# Altium project KeyBoard.PrjPcb
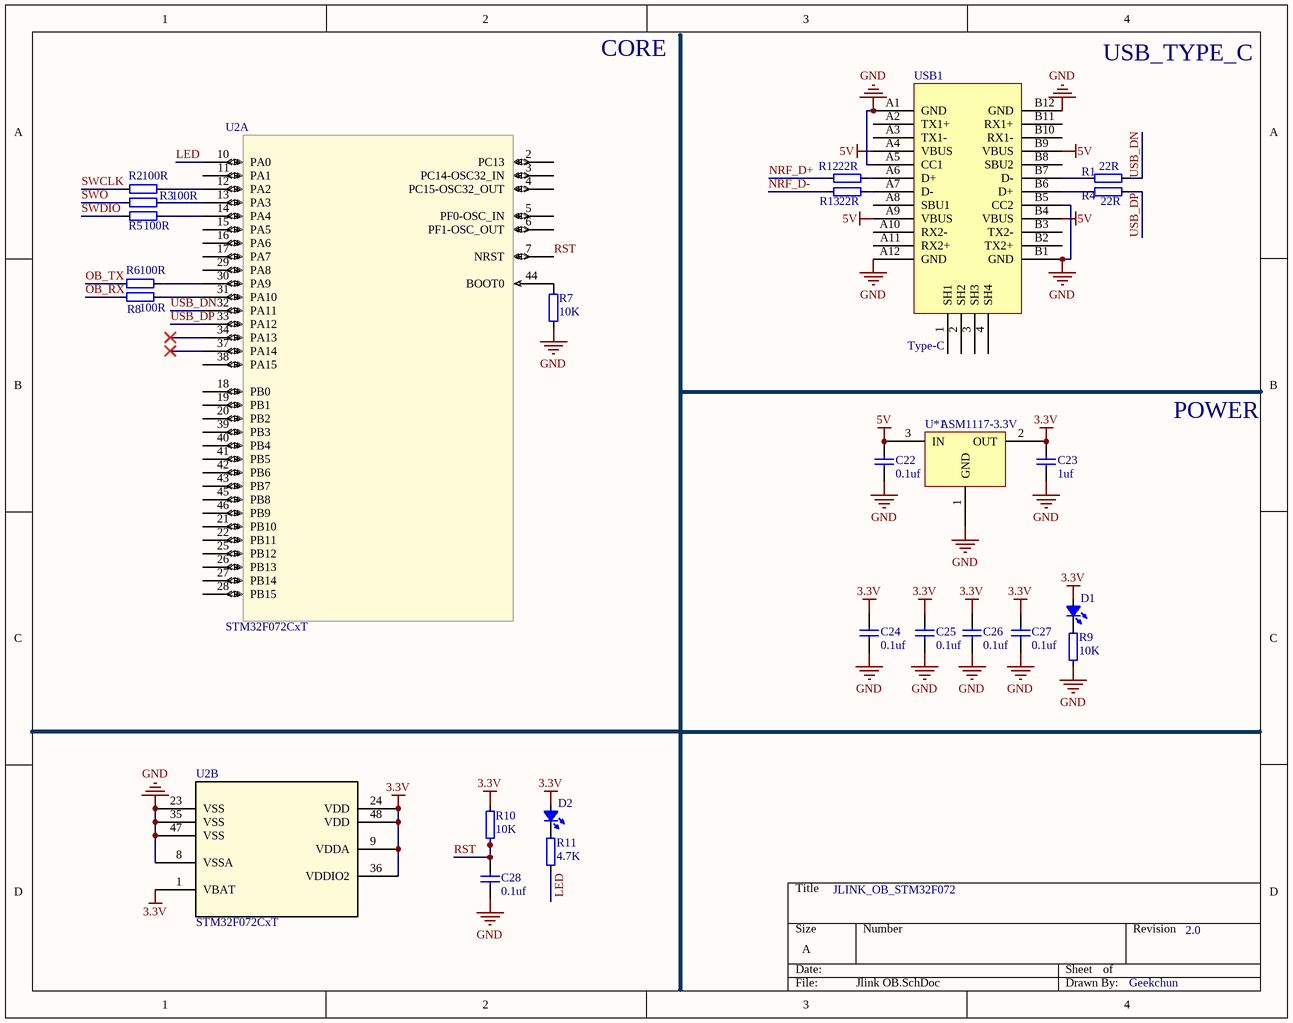
[diagram p0: Jlink OB.SchDoc]
3 sheets, 83 parts. Net scope: global (net labels, ports and power ports of the same name join across sheets).
Board file: KeyBoard.PcbDoc
Sheets:
  Jlink OB.SchDoc
  NRF52840.SchDoc
  Keys.SchDoc

## Sheet Jlink OB.SchDoc
size A

### Parts
C22  0.1uf  [C 0603_L]
C23  1uf  [C 0603_L]
C24  0.1uf  [C 0603_L]
C25  0.1uf  [C 0603_L]
C26  0.1uf  [C 0603_L]
C27  0.1uf  [C 0603_L]
C28  0.1uf  [C 0603_L]
D1  LED_0603  [LED 0603B]  (value not drawn)
D2  LED_0603  [LED 0603B]  (value not drawn)
R1  22R  [R 0603_L]
R2  100R  [R 0603_L]
R3  100R  [R 0603_L]
R4  22R  [R 0603_L]
R5  100R  [R 0603_L]
R6  100R  [R 0603_L]
R7  10K  [R 0603_L]
R8  100R  [R 0603_L]
R9  10K  [R 0603_L]
R10  10K  [R 0603_L]
R11  4.7K  [R 0603_L]
R12  22R  [R 0603_L]
R13  22R  [R 0603_L]
U2  STM32F072CxT  [LQFP48 7X7_L]  (parts A,B of 2)
U*1  ASM1117-3.3V  [SOT-89]
USB1  Type-C  [usb typec]

### Nets
3.3V: C23.2 C24.2 C25.2 C26.2 C27.2 D1.1(A) D2.1(A) R10.2 U2.1(VBAT) U2.9(VDDA) U2.24(VDD) U2.36(VDDIO2) U2.48(VDD) U*1.2(OUT)
5V: C22.2 U*1.3(IN) USB1.A4(VBUS) USB1.A9(VBUS) USB1.B4(VBUS) USB1.B9(VBUS)
GND: C22.1 C23.1 C24.1 C25.1 C26.1 C27.1 C28.1 R7.2 R9.1 U2.8(VSSA) U2.23(VSS) U2.35(VSS) U2.47(VSS) U*1.1(GND) USB1.A1(GND) USB1.A5(CC1) USB1.A12(GND) USB1.B1(GND) USB1.B5(CC2) USB1.B12(GND)
LED: R11.1 U2.10(PA0)
NRF_D+: R12.1
NRF_D-: R13.1
OB_RX: R8.1
OB_TX: R6.1
RST: C28.2 R10.1 U2.7(NRST)
SWCLK: R2.1
SWDIO: R5.1
SWO: R3.1
USB_DN: R1.2 U2.32(PA11)
USB_DP: R4.2 U2.33(PA12)
NetD1_2: D1.2(K) R9.2
NetD2_2: D2.2(K) R11.2
NetR1_1: R1.1 USB1.B7(D-)
NetR2_2: R2.2 U2.12(PA2)
NetR3_2: R3.2 U2.13(PA3)
NetR4_1: R4.1 USB1.B6(D+)
NetR5_2: R5.2 U2.14(PA4)
NetR6_2: R6.2 U2.30(PA9)
NetR7_1: R7.1 U2.44(BOOT0)
NetR8_2: R8.2 U2.31(PA10)
NetR12_2: R12.2 USB1.A6(D+)
NetR13_2: R13.2 USB1.A7(D-)

Not connected (* = marked no-connect by the designer): U2 2(PC13) 3(PC14-OSC32_IN) 4(PC15-OSC32_OUT) 5(PF0-OSC_IN) 6(PF1-OSC_OUT) 11(PA1) 15(PA5) 16(PA6) 17(PA7) 18(PB0) 19(PB1) 20(PB2) 21(PB10) 22(PB11) 25(PB12) 26(PB13) 27(PB14) 28(PB15) 29(PA8) 34(PA13)* 37(PA14)* 38(PA15) 39(PB3) 40(PB4) 41(PB5) 42(PB6) 43(PB7) 45(PB8) 46(PB9); USB1 1(SH1) 2(SH2) 3(SH3) 4(SH4) A2(TX1+) A3(TX1-) A8(SBU1) A10(RX2-) A11(RX2+) B2(TX2+) B3(TX2-) B8(SBU2) B10(RX1-) B11(RX1+)

### Notes on the sheet
- CORE
- USB_TYPE_C
- POWER
- JLINK_OB_STM32F072
- 2.0
- Geekchun

### Library data of the parts
C22-C28 = CAP: Capacitor, NP0, ?.1pF; Part Number: C0402-1.2p; Value: 1.2pF; Note: 50V; Artikkelnr Noca: 20029157; Artikkelnr Simpro: N.A.; Manufacturer: *; Manufacturer Part Number: *; Datasheet: *; LatestRevisionDate: 2011-05-11; Pin Count: 2; Publisher: Nordic Semiconductor; Published: 2009-05-08; Supplier: *; Supplier part number: *; 2nd source Supplier: *; 2nd source part number: *; Footprint Doc: 0402
D1 D2 = LED_0603: LED
R1-R13 = RES
U2 = STM32F072CxT: Imported; Vendor: STMicroelectronics; C: Copyright (C) 2016 Accelerated Designs. All rights reserved; Copyright: Copyright (C) 2016 Accelerated Designs. All rights reserved; Manufacturer_Part_Number: stm32f072cxt; RefDes: RefDes; Type: Type; Value: Value
U*1 = ASM1117-3.3V: 三端可调或固定电压3.3V

## Sheet NRF52840.SchDoc
size A4
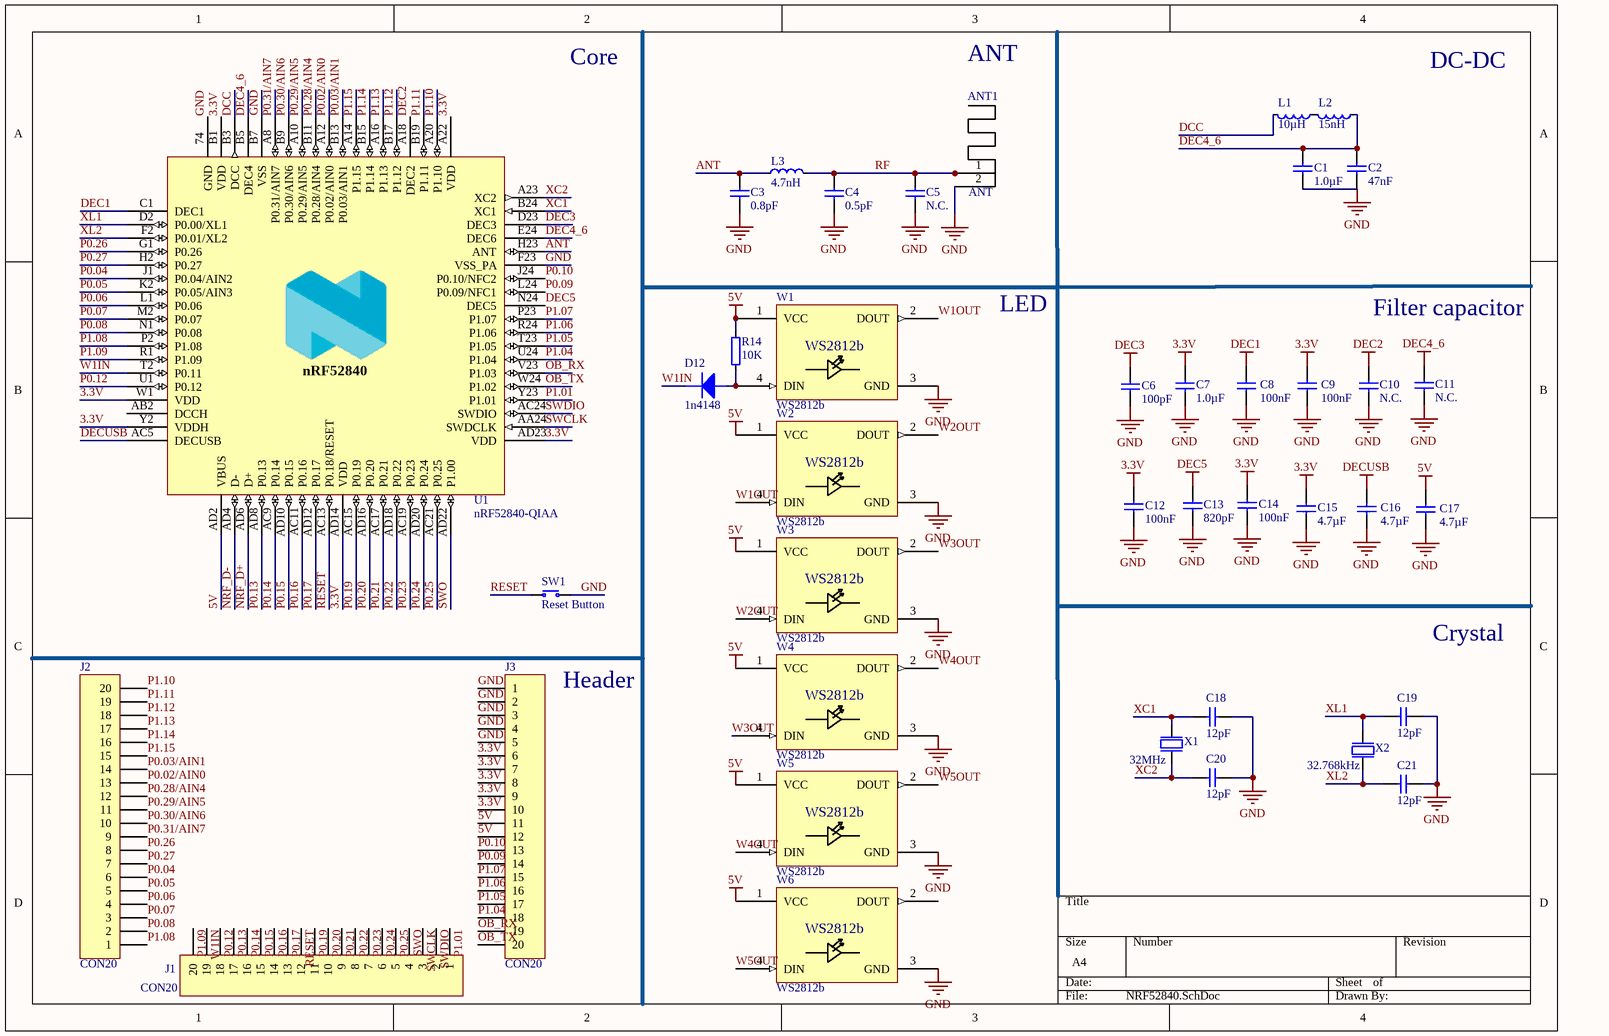
[diagram p1: NRF52840.SchDoc]

### Parts
ANT1  ANT  [ANT-PCB-2.4G-IFA-AN043-TI-ORIGIN]
C1  1.0µF  [C 0402_L]
C2  47nF  [C 0402_L]
C3  0.8pF  [C 0402_L]
C4  0.5pF  [C 0402_L]
C5  N.C.  [C 0402_L]
C6  100pF  [C 0402_L]
C7  1.0µF  [C 0402_L]
C8  100nF  [C 0402_L]
C9  100nF  [C 0402_L]
C10  N.C.  [C 0402_L]
C11  N.C.  [C 0402_L]
C12  100nF  [C 0402_L]
C13  820pF  [C 0402_L]
C14  100nF  [C 0402_L]
C15  4.7µF  [C 0402_L]
C16  4.7µF  [C 0402_L]
C17  4.7µF  [C 0402_L]
C18  12pF  [C 0402_L]
C19  12pF  [C 0402_L]
C20  12pF  [C 0402_L]
C21  12pF  [C 0402_L]
D12  1n4148  [SOD-123]
J1  CON20  [HDR2.54-LI-20P]
J2  CON20  [HDR2.54-LI-20P]
J3  CON20  [HDR2.54-LI-20P]
L1  10µH  [L 0603]
L2  15nH  [L 0603]
L3  4.7nH  [L 0402]
R14  10K  [R 0603_L]
SW1  Reset Button  [TSW SMD-6*6*5]
U1  nRF52840-QIAA  [AQFN50P700X700X85_HS-74N]
W1  WS2812b  [DIOC500500X250_NR]
W2  WS2812b  [DIOC500500X250_NR]
W3  WS2812b  [DIOC500500X250_NR]
W4  WS2812b  [DIOC500500X250_NR]
W5  WS2812b  [DIOC500500X250_NR]
W6  WS2812b  [DIOC500500X250_NR]
X1  32MHz  [OSC 3225-4P]
X2  32.768kHz  [OSC 3215-2P]

### Nets
3.3V: C7.1 C9.1 C12.1 C14.1 C15.1 J3.6 J3.7 J3.8 J3.9 J3.10 U1.A22(VDD) U1.AD14(VDD) U1.AD23(VDD) U1.B1(VDD) U1.W1(VDD) U1.Y2(VDDH)
5V: C17.1 J3.11 J3.12 R14.1 U1.AD2(VBUS) W1.1(VCC) W2.1(VCC) W3.1(VCC) W4.1(VCC) W5.1(VCC) W6.1(VCC)
DEC1: C8.1 U1.C1(DEC1)
DEC2: C10.1 U1.A18(DEC2)
DEC3: C6.2 U1.D23(DEC3)
DEC4_6: C1.2 C2.1 C11.1 L2.1 U1.B5(DEC4) U1.E24(DEC6)
DEC5: C13.1 U1.N24(DEC5)
DECUSB: C16.1 U1.AC5(DECUSB)
GND: ANT1.2 C1.1 C2.2 C3.1 C4.1 C5.2 C6.1 C7.2 C8.2 C9.2 C10.2 C11.2 C12.2 C13.2 C14.2 C15.2 C16.2 C17.2 C18.2 C19.2 C20.2 C21.2 J3.1 J3.2 J3.3 J3.4 J3.5 SW1.1(N.O) U1.74(GND) U1.B7(VSS) U1.F23(VSS_PA) W1.3(GND) W2.3(GND) W3.3(GND) W4.3(GND) W5.3(GND) W6.3(GND) X1.2(GND) X1.4(GND)
ANT: C3.2 L3.1 U1.H23(ANT)
DCC: L1.2 U1.B3(DCC)
NRF_D+: U1.AD6(D+)
NRF_D-: U1.AD4(D-)
OB_RX: J3.19 U1.V23(P1.03)
OB_TX: J3.20 U1.W24(P1.02)
P0.02/AIN0: J2.13 U1.A12(P0.02/AIN0)
P0.03/AIN1: J2.14 U1.B13(P0.03/AIN1)
P0.04: J2.6 U1.J1(P0.04/AIN2)
P0.05: J2.5 U1.K2(P0.05/AIN3)
P0.06: J2.4 U1.L1(P0.06)
P0.07: J2.3 U1.M2(P0.07)
P0.08: J2.2 U1.N1(P0.08)
P0.09: J3.14 U1.L24(P0.09/NFC1)
P0.10: J3.13 U1.J24(P0.10/NFC2)
P0.12: J1.18 U1.U1(P0.12)
P0.13: J1.17 U1.AD8(P0.13)
P0.14: J1.16 U1.AC9(P0.14)
P0.15: J1.15 U1.AD10(P0.15)
P0.16: J1.14 U1.AC11(P0.16)
P0.17: J1.13 U1.AD12(P0.17)
P0.19: J1.11 U1.AC15(P0.19)
P0.20: J1.10 U1.AD16(P0.20)
P0.21: J1.9 U1.AC17(P0.21)
P0.22: J1.8 U1.AD18(P0.22)
P0.23: J1.7 U1.AC19(P0.23)
P0.24: J1.6 U1.AD20(P0.24)
P0.25: J1.5 U1.AC21(P0.25)
P0.26: J2.8 U1.G1(P0.26)
P0.27: J2.7 U1.H2(P0.27)
P0.28/AIN4: J2.12 U1.B11(P0.28/AIN4)
P0.29/AIN5: J2.11 U1.A10(P0.29/AIN5)
P0.30/AIN6: J2.10 U1.B9(P0.30/AIN6)
P0.31/AIN7: J2.9 U1.A8(P0.31/AIN7)
P1.01: J1.1 U1.Y23(P1.01)
P1.04: J3.18 U1.U24(P1.04)
P1.05: J3.17 U1.T23(P1.05)
P1.06: J3.16 U1.R24(P1.06)
P1.07: J3.15 U1.P23(P1.07)
P1.08: J2.1 U1.P2(P1.08)
P1.09: J1.20 U1.R1(P1.09)
P1.10: J2.20 U1.A20(P1.10)
P1.11: J2.19 U1.B19(P1.11)
P1.12: J2.18 U1.B17(P1.12)
P1.13: J2.17 U1.A16(P1.13)
P1.14: J2.16 U1.B15(P1.14)
P1.15: J2.15 U1.A14(P1.15)
RESET: J1.12 SW1.2(COM) U1.AC13(P0.18/RESET)
RF: ANT1.1 C4.2 C5.1 L3.2
SWCLK: J1.3 U1.AA24(SWDCLK)
SWDIO: J1.2 U1.AC24(SWDIO)
SWO: J1.4 U1.AD22(P1.00)
W1IN: D12.2(K) J1.19 U1.T2(P0.11)
W1OUT: W1.2(DOUT) W2.4(DIN)
W2OUT: W2.2(DOUT) W3.4(DIN)
W3OUT: W3.2(DOUT) W4.4(DIN)
W4OUT: W4.2(DOUT) W5.4(DIN)
W5OUT: W5.2(DOUT) W6.4(DIN)
XC1: C18.1 U1.B24(XC1) X1.3(out)
XC2: C20.1 U1.A23(XC2) X1.1(inp)
XL1: C19.1 U1.D2(P0.00/XL1) X2.2(out)
XL2: C21.1 U1.F2(P0.01/XL2) X2.1(inp)
NetD12_1: D12.1(A) R14.2 W1.4(DIN)
NetL1_1: L1.1 L2.2

Not connected (* = marked no-connect by the designer): U1 AB2(DCCH); W6 2(DOUT)

### Notes on the sheet
- Core
- ANT
- DC-DC
- LED
- Filter capacitor
- Crystal
- Header
- (in symbol nRF52840-QIAAD0) nRF52840

### Library data of the parts
C1 C7 = C0603-1µ0: Capacitor, X7R, ±10%; Note: 16V; Part Number: C0603-1µ0; LatestRevisionDate: 2013-06-05; Pin Count: 2; Publisher: Nordic Semiconductor; Published: 2009-05-08; Value: 1.0µF; Footprint Doc: 0603
C2 = C0402-47n: Capacitor, X7R, ±10%; Note: Chip Cap 10%; Part Number: C0402-47n; LatestRevisionDate: 2009-05-08; Pin Count: 2; Publisher: Nordic Semiconductor; Published: 2009-05-08; Value: 47nF; Footprint Doc: 0402
C3 = C0402-0.8p: Capacitor, NP0, ±10%; Note: 50V; Part Number: C0402-0.8p; LatestRevisionDate: 2012-11-21; Pin Count: 2; Publisher: Nordic Semiconductor; Published: 2009-05-08; Value: 0.8pF; Footprint Doc: 0402
C4 = C0402-0.5p: Capacitor, NP0, ±10%; Note: 50V; Part Number: C0402-0.5p; LatestRevisionDate: 2017-02-23; Pin Count: 2; Publisher: Nordic Semiconductor; Published: 2009-05-08; Value: 0.5pF; Footprint Doc: 0402
C5 = C0402-N.C.: Not mounted; Note: Chip Cap; Assembly: Not mounted; Part Number: C0402-N.C.; LatestRevisionDate: 2009-05-08; Pin Count: 2; Publisher: Nordic Semiconductor; Published: 2009-05-08; Value: N.C.; Footprint Doc: 0402
C6 = C0402-100p: Capacitor, NP0, ±5%; Note: 50V; Part Number: C0402-100p; LatestRevisionDate: 2009-05-08; Pin Count: 2; Publisher: Nordic Semiconductor; Published: 2009-05-08; Value: 100pF; Footprint Doc: 0402
C8 C9 C12 C14 = C0402-100n: Capacitor, X7R, ±10%; Note: 16V; Part Number: C0402-100n; LatestRevisionDate: 2009-11-23; Pin Count: 2; Publisher: Nordic Semiconductor; Published: 2009-05-08; Value: 100nF; Footprint Doc: 0402
C10 C11 = C0402-N.C.: Not mounted; Assembly: Not mounted; Part Number: C0402-N.C.; LatestRevisionDate: 2009-05-08; Pin Count: 2; Publisher: Nordic Semiconductor; Published: 2009-05-08; Value: N.C.; Footprint Doc: 0402
C13 = C0402-820p: Capacitor, NP0, ±5%; Note: 50V; Part Number: C0402-820p; LatestRevisionDate: 2009-05-08; Pin Count: 2; Publisher: Nordic Semiconductor; Published: 2009-05-08; Value: 820pF; Footprint Doc: 0402
C15 C16 = C0603-4µ7-6.3V-X7R: Capacitor, X7R, ±10%; Note: 6.3V; Part Number: C0603-4µ7-6.3V-X7R; LatestRevisionDate: 2015-06-10; Pin Count: 2; Publisher: Nordic Semiconductor; Published: 2015-06-10; Value: 4.7µF; Footprint Doc: 0603
C17 = C0603-4µ7-10V-X7S: Capacitor, X7S, ±10%; Note: 10V; Part Number: C0603-4µ7-10V-X7S; LatestRevisionDate: 2016-08-15; Pin Count: 2; Publisher: Nordic Semiconductor; Published: 2016-08-15; Value: 4.7µF; Footprint Doc: 0603
C18-C21 = C0402-12p: Capacitor, NP0, ±2%; Note: 50V; Part Number: C0402-12p; LatestRevisionDate: 2011-05-11; Pin Count: 2; Publisher: Nordic Semiconductor; Published: 2009-05-08; Value: 12pF; Footprint Doc: 0402
D12 = ZENER3: Zener Diode
J1-J3 = CON20: Connector
L1 = L0603-10µ: Chip inductor, IDC,min = 50 mA, ±20%; Part Number: L0603-10µ; LatestRevisionDate: 2012-09-19; Pin Count: 2; Publisher: Nordic Semiconductor; Published: 2010-02-24; Value: 10µH; Footprint Doc: 0603
L2 = L0402-15n: High frequency chip inductor ±10%; Part Number: L0402-15n; LatestRevisionDate: 2012-09-19; Pin Count: 2; Publisher: Nordic Semiconductor; Published: 2010-07-12; Value: 15nH; Footprint Doc: 0402
L3 = L0402-4n7: High frequency chip inductor ±5%; Part Number: L0402-4n7; LatestRevisionDate: 2012-09-19; Pin Count: 2; Publisher: Nordic Semiconductor; Published: 2009-05-08; Value: 4.7nH; Note: High frequency chip inductor ±5%; Footprint Doc: 0402
R14 = RES
SW1 = SW-PB: Tactile Switch, SPNO, SMD, 160gf, 6.2x6.3x2.5mm; Part Number: Switch-PB-6.2x6.3mm-SMD; Manufacturer: Dailywell; Manufacturer Part Number: TS604VM1-025BR-R; 2nd source part number: 688-SKHUALE010; Value: PB SW; Artikkelnr Noca: 50019106; Artikkelnr Simpro: N.A.; Datasheet: \\hizz\pro\app9717\Datasheet\switches\Daliywell\TS604VM1-025BR-R.pdf; Footprint Doc: Switch-PB-6.2x6.3mm-SMD; LatestRevisionDate: 2016-04-21; Pin Count: 4; Publisher: Nordic Semiconductor; Published: 2010-02-01; Note: *; Supplier: Cabcon; Supplier part number: TS604VM1-025BR-R; 2nd source Supplier: Mouser
U1 = nRF52840-QIAAD0: Multi-protocol Bluetooth Low Energy, IEEE 802.15.4, ANT and 2.4GHz proprietary system-on-chip; Manufacturer: Nordic Semiconductor; Part Number: nRF52840-QIAAD0; LatestRevisionDate: 2018-12-04; Pin Count: 73; Publisher: Nordic Semiconductor; Published: 2018-12-04; Value: nRF52840-QIAA; Note: *; Footprint Doc: AQFN-73; Manufacturer Part Number: nRF52840-QIAAD0
W1-W6 = WS2812b_Sumasta: The Infamous Chinese Chainable RGB LED
X1 = XTAL_SMD2016_32MHz_8pF_General: XTAL SMD 2016, 32MHz, Cl=8pF, Total Tol: ±40ppm; Part Number: XTAL_SMD2016_32MHz_8pF_General; LatestRevisionDate: 2016-08-19; Pin Count: 4; Publisher: Nordic Semiconductor; Published: 2016-08-19; Value: 32MHz; Footprint Doc: XTAL_2016
X2 = XTAL_SMD3215_32.768kHz_9pF_General: XTAL SMD 3215, 32.768kHz, Cl=9pF, Total Tol: ±50ppm; Part Number: XTAL_SMD3215_32.768kHz_9pF_General; LatestRevisionDate: 2016-08-19; Pin Count: 2; Publisher: Nordic Semiconductor; Published: 2016-08-19; Value: 32.768kHz; Footprint Doc: XTAL_3215

## Sheet Keys.SchDoc
size A
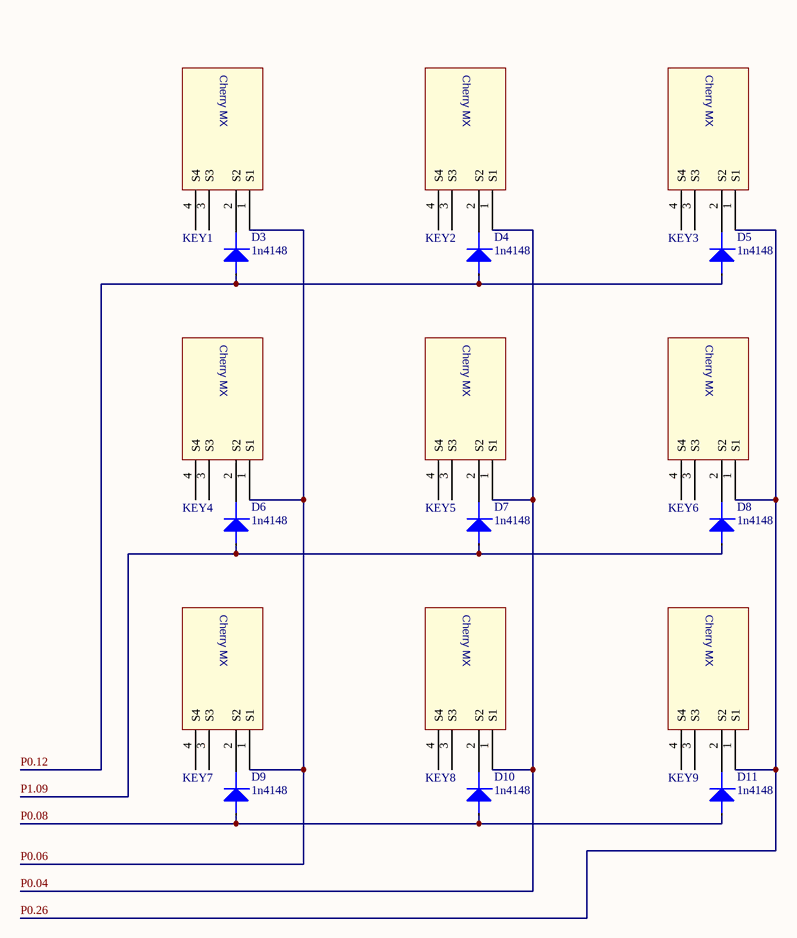
[diagram p2: Keys.SchDoc]

### Parts
D3  1n4148  [SOD-123]
D4  1n4148  [SOD-123]
D5  1n4148  [SOD-123]
D6  1n4148  [SOD-123]
D7  1n4148  [SOD-123]
D8  1n4148  [SOD-123]
D9  1n4148  [SOD-123]
D10  1n4148  [SOD-123]
D11  1n4148  [SOD-123]
KEY1  CHERRY_MX  [CHERRYMX]  (value not drawn)
KEY2  CHERRY_MX  [CHERRYMX]  (value not drawn)
KEY3  CHERRY_MX  [CHERRYMX]  (value not drawn)
KEY4  CHERRY_MX  [CHERRYMX]  (value not drawn)
KEY5  CHERRY_MX  [CHERRYMX]  (value not drawn)
KEY6  CHERRY_MX  [CHERRYMX]  (value not drawn)
KEY7  CHERRY_MX  [CHERRYMX]  (value not drawn)
KEY8  CHERRY_MX  [CHERRYMX]  (value not drawn)
KEY9  CHERRY_MX  [CHERRYMX]  (value not drawn)

### Nets
P0.04: KEY2.1(S1) KEY5.1(S1) KEY8.1(S1)
P0.06: KEY1.1(S1) KEY4.1(S1) KEY7.1(S1)
P0.08: D9.1(A) D10.1(A) D11.1(A)
P0.12: D3.1(A) D4.1(A) D5.1(A)
P0.26: KEY3.1(S1) KEY6.1(S1) KEY9.1(S1)
P1.09: D6.1(A) D7.1(A) D8.1(A)
NetD3_2: D3.2(K) KEY1.2(S2)
NetD4_2: D4.2(K) KEY2.2(S2)
NetD5_2: D5.2(K) KEY3.2(S2)
NetD6_2: D6.2(K) KEY4.2(S2)
NetD7_2: D7.2(K) KEY5.2(S2)
NetD8_2: D8.2(K) KEY6.2(S2)
NetD9_2: D9.2(K) KEY7.2(S2)
NetD10_2: D10.2(K) KEY8.2(S2)
NetD11_2: D11.2(K) KEY9.2(S2)

Not connected (* = marked no-connect by the designer): KEY1 3(S3) 4(S4); KEY2 3(S3) 4(S4); KEY3 3(S3) 4(S4); KEY4 3(S3) 4(S4); KEY5 3(S3) 4(S4); KEY6 3(S3) 4(S4); KEY7 3(S3) 4(S4); KEY8 3(S3) 4(S4); KEY9 3(S3) 4(S4)

### Notes on the sheet
- (in symbol CHERRY_MX) Cherry MX

### Library data of the parts
D3-D11 = ZENER3: Zener Diode

## Nets that join several sheets
3.3V: Jlink OB (14 pins), NRF52840 (16 pins)
5V: Jlink OB (6 pins), NRF52840 (11 pins)
GND: Jlink OB (20 pins), NRF52840 (39 pins)
NRF_D+: Jlink OB (R12.1), NRF52840 (U1.AD6)
NRF_D-: Jlink OB (R13.1), NRF52840 (U1.AD4)
OB_RX: Jlink OB (R8.1), NRF52840 (J3.19 U1.V23)
OB_TX: Jlink OB (R6.1), NRF52840 (J3.20 U1.W24)
P0.04: NRF52840 (J2.6 U1.J1), Keys (KEY2.1 KEY5.1 KEY8.1)
P0.06: NRF52840 (J2.4 U1.L1), Keys (KEY1.1 KEY4.1 KEY7.1)
P0.08: NRF52840 (J2.2 U1.N1), Keys (D9.1 D10.1 D11.1)
P0.12: NRF52840 (J1.18 U1.U1), Keys (D3.1 D4.1 D5.1)
P0.26: NRF52840 (J2.8 U1.G1), Keys (KEY3.1 KEY6.1 KEY9.1)
P1.09: NRF52840 (J1.20 U1.R1), Keys (D6.1 D7.1 D8.1)
SWCLK: Jlink OB (R2.1), NRF52840 (J1.3 U1.AA24)
SWDIO: Jlink OB (R5.1), NRF52840 (J1.2 U1.AC24)
SWO: Jlink OB (R3.1), NRF52840 (J1.4 U1.AD22)